# Altium project f407zgt6.PrjPcb
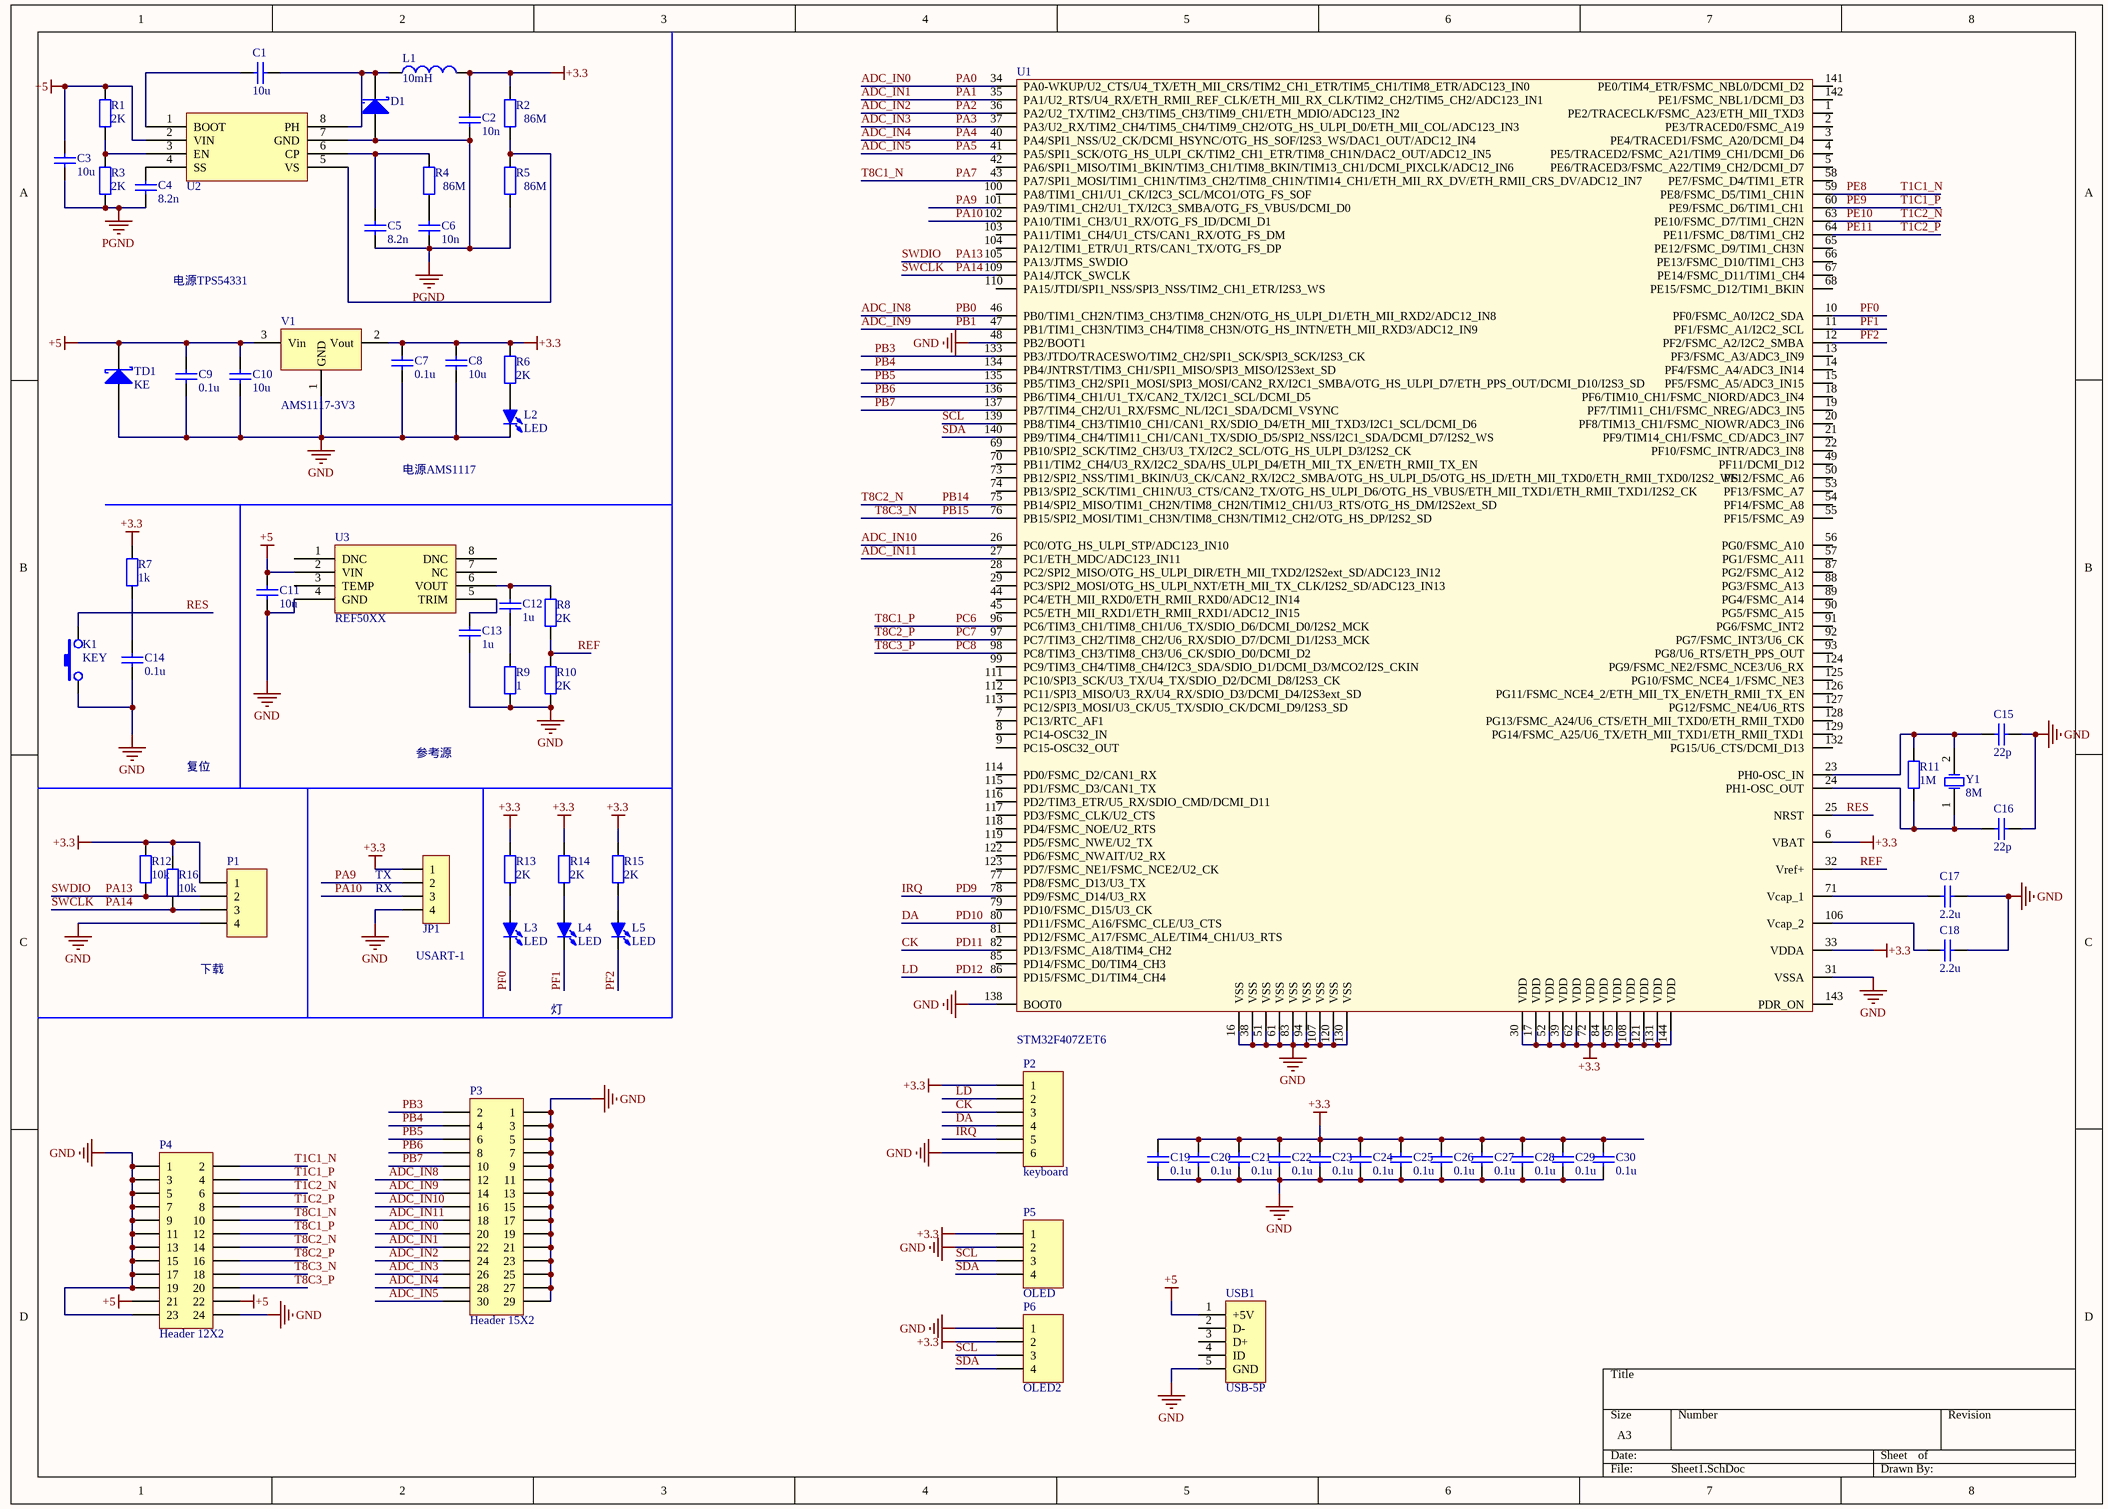
[diagram p0: Sheet1.SchDoc]
1 sheet, 67 parts. Net scope: global (net labels, ports and power ports of the same name join across sheets).
Board file: PCB1.PcbDoc

## Sheet Sheet1.SchDoc
size A3; SheetNumber: 1; SheetTotal: 1

### Parts
C1  10u  [6-0805_N]
C2  10n  [6-0805_N]
C3  10u  [6-0805_N]
C4  8.2n  [6-0805_N]
C5  8.2n  [6-0805_N]
C6  10n  [6-0805_N]
C7  0.1u  [C 0603_L]
C8  10u  [C 0805_L]
C9  0.1u  [C 0805_L]
C10  10u  [C 0603_L]
C11  10u  [C 0603_L]
C12  1u  [C 0603_L]
C13  1u  [C 0603_L]
C14  0.1u  [C 0603_L]
C15  22p  [C 0603_L]
C16  22p  [C 0603_L]
C17  2.2u  [C 0805_M]
C18  2.2u  [C 0805_M]
C19  0.1u  [C 0603_L]
C20  0.1u  [C 0603_L]
C21  0.1u  [C 0603_L]
C22  0.1u  [C 0603_L]
C23  0.1u  [C 0603_L]
C24  0.1u  [C 0603_L]
C25  0.1u  [C 0603_L]
C26  0.1u  [C 0603_L]
C27  0.1u  [C 0603_L]
C28  0.1u  [C 0603_L]
C29  0.1u  [C 0603_L]
C30  0.1u  [C 0603_L]
D1  D Schottky  [SMA]  (value not drawn)
JP1  HDR-1X4  [XH2.54-WI-4P]  (value not drawn)
K1  KEY  [KEY-6*6*6]
L1  value 10mH  [SWPA4030S]  (hidden comment: Inductor)
L2  LED  [LED 0805G]
L3  LED  [LED 0805G]
L4  LED  [LED 0805G]
L5  LED  [LED 0805G]
P1  下载  [XH2.54-WI-4P]
P2  keyboard  [XH2.54-WI-6P]
P3  Header 15X2  [HDR2.54-WI-2x15P]
P4  Header 12X2  [HDR2.54-WI-2x12P]
P5  OLED  [HDR2.54-M-LI-4P]
P6  OLED2  [HDR2.54-M-LI-4P]
R1  2K  [R 0603_L]
R2  86M  [R 0603_L]
R3  2K  [R 0603_L]
R4  86M  [R 0603_L]
R5  86M  [R 0603_L]
R6  2K  [R 0603_L]
R7  1k  [R 0603_L]
R8  2K  [R 0603_L]
R9  1  [R 0603_L]
R10  2K  [R 0603_L]
R11  1M  [R 0603_L]
R12  10k  [R 0603_L]
R13  2K  [R 0603_L]
R14  2K  [R 0603_L]
R15  2K  [R 0603_L]
R16  10k  [R 0603_L]
TD1  KE  [SMB]
U1  STM32F407ZET6  [LQFP144]
U2  TPS54331  [tps5450]  (value not drawn)
U3  REF50XX  [SO-8]
USB1  USB-5P  [USB-micro_A]
V1  AMS1117-3V3  [SOT223_N]
Y1  8M  [OSC HC-49SMD]

### Nets
+3.3: C2.1 C7.2 C8.2 C19.2 C20.2 C21.2 C22.2 C23.2 C24.2 C25.2 C26.2 C27.2 C28.2 C29.2 C30.2 JP1.1 L1.2 P1.1 P2.1 P5.1 P6.2 R2.2 R6.2 R7.2 R12.2 R13.2 R14.2 R15.2 R16.2 U1.6(VBAT) U1.17(VDD) U1.30(VDD) U1.33(VDDA) U1.39(VDD) U1.52(VDD) U1.62(VDD) U1.72(VDD) U1.84(VDD) U1.95(VDD) U1.108(VDD) U1.121(VDD) U1.131(VDD) U1.144(VDD) V1.2(Vout)
+5: C3.1 C9.2 C10.2 C11.2 P4.21 P4.22 R1.2 TD1.2(K) U2.2(VIN) U3.2(VIN) USB1.1(+5V) V1.3(Vin)
GND: C7.1 C8.1 C9.1 C10.1 C11.1 C13.1 C14.1 C15.2 C16.2 C17.2 C18.2 C19.1 C20.1 C21.1 C22.1 C23.1 C24.1 C25.1 C26.1 C27.1 C28.1 C29.1 C30.1 JP1.4 K1.1 L2.2(K) P1.4 P2.6 P3.1 P3.3 P3.5 P3.7 P3.9 P3.11 P3.13 P3.15 P3.17 P3.19 P3.21 P3.23 P3.25 P3.27 P3.29 P4.1 P4.3 P4.5 P4.7 P4.9 P4.11 P4.13 P4.15 P4.17 P4.19 P4.23 P4.24 P5.2 P6.1 R9.1 R10.1 TD1.1(A) U1.16(VSS) U1.31(VSSA) U1.38(VSS) U1.48(PB2/BOOT1) U1.51(VSS) U1.61(VSS) U1.83(VSS) U1.94(VSS) U1.107(VSS) U1.120(VSS) U1.130(VSS) U1.138(BOOT0) U3.4(GND) USB1.5(GND) V1.1(GND)
PGND: C2.2 C3.2 C4.2 C5.2 C6.2 D1.1(A) R3.1 R5.1 U2.7(GND)
ADC_IN0: P3.20 U1.34(PA0-WKUP/U2_CTS/U4_TX/ETH_MII_CRS/TIM2_CH1_ETR/TIM5_CH1/TIM8_ETR/ADC123_IN0)  [also labelled PA0]
ADC_IN1: P3.22 U1.35(PA1/U2_RTS/U4_RX/ETH_RMII_REF_CLK/ETH_MII_RX_CLK/TIM2_CH2/TIM5_CH2/ADC123_IN1)  [also labelled PA1]
ADC_IN2: P3.24 U1.36(PA2/U2_TX/TIM2_CH3/TIM5_CH3/TIM9_CH1/ETH_MDIO/ADC123_IN2)  [also labelled PA2]
ADC_IN3: P3.26 U1.37(PA3/U2_RX/TIM2_CH4/TIM5_CH4/TIM9_CH2/OTG_HS_ULPI_D0/ETH_MII_COL/ADC123_IN3)  [also labelled PA3]
ADC_IN4: P3.28 U1.40(PA4/SPI1_NSS/U2_CK/DCMI_HSYNC/OTG_HS_SOF/I2S3_WS/DAC1_OUT/ADC12_IN4)  [also labelled PA4]
ADC_IN5: P3.30 U1.41(PA5/SPI1_SCK/OTG_HS_ULPI_CK/TIM2_CH1_ETR/TIM8_CH1N/DAC2_OUT/ADC12_IN5)  [also labelled PA5]
ADC_IN8: P3.12 U1.46(PB0/TIM1_CH2N/TIM3_CH3/TIM8_CH2N/OTG_HS_ULPI_D1/ETH_MII_RXD2/ADC12_IN8)  [also labelled PB0]
ADC_IN9: P3.14 U1.47(PB1/TIM1_CH3N/TIM3_CH4/TIM8_CH3N/OTG_HS_INTN/ETH_MII_RXD3/ADC12_IN9)  [also labelled PB1]
ADC_IN10: P3.16 U1.26(PC0/OTG_HS_ULPI_STP/ADC123_IN10)
ADC_IN11: P3.18 U1.27(PC1/ETH_MDC/ADC123_IN11)
CK: P2.3 U1.82(PD13/FSMC_A18/TIM4_CH2)  [also labelled PD11]
DA: P2.4 U1.80(PD11/FSMC_A16/FSMC_CLE/U3_CTS)  [also labelled PD10]
IRQ: P2.5 U1.78(PD9/FSMC_D14/U3_RX)  [also labelled PD9]
LD: P2.2 U1.86(PD15/FSMC_D1/TIM4_CH4)  [also labelled PD12]
PA7: P4.10 U1.43(PA7/SPI1_MOSI/TIM1_CH1N/TIM3_CH2/TIM8_CH1N/TIM14_CH1/ETH_MII_RX_DV/ETH_RMII_CRS_DV/ADC12_IN7)  [also labelled T8C1_N]
PA9: JP1.2 U1.101(PA9/TIM1_CH2/U1_TX/I2C3_SMBA/OTG_FS_VBUS/DCMI_D0)
PA10: JP1.3 U1.102(PA10/TIM1_CH3/U1_RX/OTG_FS_ID/DCMI_D1)
PA13: P1.2 R12.1 U1.105(PA13/JTMS_SWDIO)  [also labelled SWDIO]
PA14: P1.3 R16.1 U1.109(PA14/JTCK_SWCLK)  [also labelled SWCLK]
PB3: P3.2 U1.133(PB3/JTDO/TRACESWO/TIM2_CH2/SPI1_SCK/SPI3_SCK/I2S3_CK)
PB4: P3.4 U1.134(PB4/JNTRST/TIM3_CH1/SPI1_MISO/SPI3_MISO/I2S3ext_SD)
PB5: P3.6 U1.135(PB5/TIM3_CH2/SPI1_MOSI/SPI3_MOSI/CAN2_RX/I2C1_SMBA/OTG_HS_ULPI_D7/ETH_PPS_OUT/DCMI_D10/I2S3_SD)
PB6: P3.8 U1.136(PB6/TIM4_CH1/U1_TX/CAN2_TX/I2C1_SCL/DCMI_D5)
PB7: P3.10 U1.137(PB7/TIM4_CH2/U1_RX/FSMC_NL/I2C1_SDA/DCMI_VSYNC)
PB14: P4.14 U1.75(PB14/SPI2_MISO/TIM1_CH2N/TIM8_CH2N/TIM12_CH1/U3_RTS/OTG_HS_DM/I2S2ext_SD)  [also labelled T8C2_N]
PB15: P4.18 U1.76(PB15/SPI2_MOSI/TIM1_CH3N/TIM8_CH3N/TIM12_CH2/OTG_HS_DP/I2S2_SD)  [also labelled T8C3_N]
PC6: P4.12 U1.96(PC6/TIM3_CH1/TIM8_CH1/U6_TX/SDIO_D6/DCMI_D0/I2S2_MCK)  [also labelled T8C1_P]
PC7: P4.16 U1.97(PC7/TIM3_CH2/TIM8_CH2/U6_RX/SDIO_D7/DCMI_D1/I2S3_MCK)  [also labelled T8C2_P]
PC8: P4.20 U1.98(PC8/TIM3_CH3/TIM8_CH3/U6_CK/SDIO_D0/DCMI_D2)  [also labelled T8C3_P]
PE8: P4.2 U1.59(PE8/FSMC_D5/TIM1_CH1N)  [also labelled T1C1_N]
PE9: P4.4 U1.60(PE9/FSMC_D6/TIM1_CH1)  [also labelled T1C1_P]
PE10: P4.6 U1.63(PE10/FSMC_D7/TIM1_CH2N)  [also labelled T1C2_N]
PE11: P4.8 U1.64(PE11/FSMC_D8/TIM1_CH2)  [also labelled T1C2_P]
PF0: L3.2(K) U1.10(PF0/FSMC_A0/I2C2_SDA)
PF1: L4.2(K) U1.11(PF1/FSMC_A1/I2C2_SCL)
PF2: L5.2(K) U1.12(PF2/FSMC_A2/I2C2_SMBA)
REF: R8.1 R10.2 U1.32(Vref+)
RES: K1.2 U1.25(NRST)
SCL: P5.3 P6.3 U1.139(PB8/TIM4_CH3/TIM10_CH1/CAN1_RX/SDIO_D4/ETH_MII_TXD3/I2C1_SCL/DCMI_D6)
SDA: P5.4 P6.4 U1.140(PB9/TIM4_CH4/TIM11_CH1/CAN1_TX/SDIO_D5/SPI2_NSS/I2C1_SDA/DCMI_D7/I2S2_WS)
NetC1_1: C1.1 D1.2(K) L1.1 U2.8(PH)
NetC1_2: C1.2 U2.1(BOOT)
NetC4_1: C4.1 U2.4(SS)
NetC5_1: C5.1 R4.2 U2.6(CP)
NetC6_1: C6.1 R4.1
NetC12_1: C12.1 R9.2
NetC12_2: C12.2 R8.2 U3.6(VOUT)
NetC13_2: C13.2 U3.5(TRIM)
NetC14_2: C14.2 R7.1
NetC15_1: C15.1 R11.2 U1.23(PH0-OSC_IN) Y1.2(OSC2)
NetC16_1: C16.1 R11.1 U1.24(PH1-OSC_OUT) Y1.1(OSC1)
NetC17_1: C17.1 U1.71(Vcap_1)
NetC18_1: C18.1 U1.106(Vcap_2)
NetL2_1: L2.1(A) R6.1
NetL3_1: L3.1(A) R13.1
NetL4_1: L4.1(A) R14.1
NetL5_1: L5.1(A) R15.1
NetR1_1: R1.1 R3.2 U2.3(EN)
NetR2_1: R2.1 R5.2 U2.5(VS)

Not connected (* = marked no-connect by the designer): U1 1(PE2/TRACECLK/FSMC_A23/ETH_MII_TXD3) 2(PE3/TRACED0/FSMC_A19) 3(PE4/TRACED1/FSMC_A20/DCMI_D4) 4(PE5/TRACED2/FSMC_A21/TIM9_CH1/DCMI_D6) 5(PE6/TRACED3/FSMC_A22/TIM9_CH2/DCMI_D7) 7(PC13/RTC_AF1) 8(PC14-OSC32_IN) 9(PC15-OSC32_OUT) 13(PF3/FSMC_A3/ADC3_IN9) 14(PF4/FSMC_A4/ADC3_IN14) 15(PF5/FSMC_A5/ADC3_IN15) 18(PF6/TIM10_CH1/FSMC_NIORD/ADC3_IN4) 19(PF7/TIM11_CH1/FSMC_NREG/ADC3_IN5) 20(PF8/TIM13_CH1/FSMC_NIOWR/ADC3_IN6) 21(PF9/TIM14_CH1/FSMC_CD/ADC3_IN7) 22(PF10/FSMC_INTR/ADC3_IN8) 28(PC2/SPI2_MISO/OTG_HS_ULPI_DIR/ETH_MII_TXD2/I2S2ext_SD/ADC123_IN12) 29(PC3/SPI2_MOSI/OTG_HS_ULPI_NXT/ETH_MII_TX_CLK/I2S2_SD/ADC123_IN13) 42(PA6/SPI1_MISO/TIM1_BKIN/TIM3_CH1/TIM8_BKIN/TIM13_CH1/DCMI_PIXCLK/ADC12_IN6) 44(PC4/ETH_MII_RXD0/ETH_RMII_RXD0/ADC12_IN14) 45(PC5/ETH_MII_RXD1/ETH_RMII_RXD1/ADC12_IN15) 49(PF11/DCMI_D12) 50(PF12/FSMC_A6) 53(PF13/FSMC_A7) 54(PF14/FSMC_A8) 55(PF15/FSMC_A9) 56(PG0/FSMC_A10) 57(PG1/FSMC_A11) 58(PE7/FSMC_D4/TIM1_ETR) 65(PE12/FSMC_D9/TIM1_CH3N) 66(PE13/FSMC_D10/TIM1_CH3) 67(PE14/FSMC_D11/TIM1_CH4) 68(PE15/FSMC_D12/TIM1_BKIN) 69(PB10/SPI2_SCK/TIM2_CH3/U3_TX/I2C2_SCL/OTG_HS_ULPI_D3/I2S2_CK) 70(PB11/TIM2_CH4/U3_RX/I2C2_SDA/HS_ULPI_D4/ETH_MII_TX_EN/ETH_RMII_TX_EN) 73(PB12/SPI2_NSS/TIM1_BKIN/U3_CK/CAN2_RX/I2C2_SMBA/OTG_HS_ULPI_D5/OTG_HS_ID/ETH_MII_TXD0/ETH_RMII_TXD0/I2S2_WS) 74(PB13/SPI2_SCK/TIM1_CH1N/U3_CTS/CAN2_TX/OTG_HS_ULPI_D6/OTG_HS_VBUS/ETH_MII_TXD1/ETH_RMII_TXD1/I2S2_CK) 77(PD8/FSMC_D13/U3_TX) 79(PD10/FSMC_D15/U3_CK) 81(PD12/FSMC_A17/FSMC_ALE/TIM4_CH1/U3_RTS) 85(PD14/FSMC_D0/TIM4_CH3) 87(PG2/FSMC_A12) 88(PG3/FSMC_A13) 89(PG4/FSMC_A14) 90(PG5/FSMC_A15) 91(PG6/FSMC_INT2) 92(PG7/FSMC_INT3/U6_CK) 93(PG8/U6_RTS/ETH_PPS_OUT) 99(PC9/TIM3_CH4/TIM8_CH4/I2C3_SDA/SDIO_D1/DCMI_D3/MCO2/I2S_CKIN) 100(PA8/TIM1_CH1/U1_CK/I2C3_SCL/MCO1/OTG_FS_SOF) 103(PA11/TIM1_CH4/U1_CTS/CAN1_RX/OTG_FS_DM) 104(PA12/TIM1_ETR/U1_RTS/CAN1_TX/OTG_FS_DP) 110(PA15/JTDI/SPI1_NSS/SPI3_NSS/TIM2_CH1_ETR/I2S3_WS) 111(PC10/SPI3_SCK/U3_TX/U4_TX/SDIO_D2/DCMI_D8/I2S3_CK) 112(PC11/SPI3_MISO/U3_RX/U4_RX/SDIO_D3/DCMI_D4/I2S3ext_SD) 113(PC12/SPI3_MOSI/U3_CK/U5_TX/SDIO_CK/DCMI_D9/I2S3_SD) 114(PD0/FSMC_D2/CAN1_RX) 115(PD1/FSMC_D3/CAN1_TX) 116(PD2/TIM3_ETR/U5_RX/SDIO_CMD/DCMI_D11) 117(PD3/FSMC_CLK/U2_CTS) 118(PD4/FSMC_NOE/U2_RTS) 119(PD5/FSMC_NWE/U2_TX) 122(PD6/FSMC_NWAIT/U2_RX) 123(PD7/FSMC_NE1/FSMC_NCE2/U2_CK) 124(PG9/FSMC_NE2/FSMC_NCE3/U6_RX) 125(PG10/FSMC_NCE4_1/FSMC_NE3) 126(PG11/FSMC_NCE4_2/ETH_MII_TX_EN/ETH_RMII_TX_EN) 127(PG12/FSMC_NE4/U6_RTS) 128(PG13/FSMC_A24/U6_CTS/ETH_MII_TXD0/ETH_RMII_TXD0) 129(PG14/FSMC_A25/U6_TX/ETH_MII_TXD1/ETH_RMII_TXD1) 132(PG15/U6_CTS/DCMI_D13) 141(PE0/TIM4_ETR/FSMC_NBL0/DCMI_D2) 142(PE1/FSMC_NBL1/DCMI_D3) 143(PDR_ON); U3 1(DNC) 3(TEMP) 7(NC) 8(DNC); USB1 2(D-) 3(D+) 4(ID)

### Notes on the sheet
- 电源TPS54331
- 电源AMS1117
- 复位
- 参考源
- (near JP1) TX
- (near JP1) RX
- USART-1
- 灯

### Library data of the parts
C1-C30 = Cap: Capacitor; Published: 8-Jun-2000; LatestRevisionDate: 17-Jul-2002; LatestRevisionNote: Re-released for DXP Platform.; PackageReference: RAD-0.3; Publisher: Altium Limited; PackageDescription: Radial Cap, Thru-Hole; 2 Leads; 0.3 in Pin Spacing
  C1 C3 C8 C10 C11: Value: 10u
  C2 C6: Value: 10n
  C4 C5: Value: 8.2n
  C7 C9 C14 C19-C30: Value: 0.1u
  C12 C13: Value: 1u
  C15 C16: Value: 22p
  C17 C18: Value: 2.2u
D1 TD1 = D Schottky: Schottky Diode; Published: 8-Jun-2000; LatestRevisionDate: 17-Jul-2002; LatestRevisionNote: Re-released for DXP Platform.; PackageReference: SMB; Publisher: Altium Limited; PackageDescription: DO-214-AA/SMB; 2 C-Bend Leads; Body 5.3 x 3.6 mm, inc. leads (LxW); Code_JEDEC: DO-214-AA
JP1 = Header 4: 4P接插件; 淘宝ID: 小糖豆的小窝窝; BOM名称: 4P接插件; 下单链接: https://item.taobao.com/item.htm?ft=t&id=613637044352
K1 = KEY: 四角直插开关; BOM名称: 四角直插开关
L1 = Inductor: Code_IEC: 1005; Published: 8-Jun-2000; LatestRevisionDate: 29-May-2009; LatestRevisionNote: IPC-7351 Footprint Added.; PackageReference: 0402-A; Publisher: Altium Limited; PackageDescription: Chip Inductor; Code_JEITA: 0402
L2-L5 = LED: 发光二极管; 淘宝ID: 小糖豆的小窝窝; BOM名称: 发光二极管; 下单链接: https://item.taobao.com/item.htm?ft=t&id=613637044352
P1 P5 P6 = Header 4: Header, 4-Pin; LatestRevisionDate: 17-Jul-2002; LatestRevisionNote: Re-released for DXP Platform.; Publisher: Altium Limited
P2 = Header 6: Header, 6-Pin; LatestRevisionDate: 17-Jul-2002; LatestRevisionNote: Re-released for DXP Platform.; Publisher: Altium Limited
P3 = Header 15X2: Header, 15-Pin, Dual row; LatestRevisionDate: 17-Jul-2002; LatestRevisionNote: Re-released for DXP Platform.; Publisher: Altium Limited
P4 = Header 12X2: Header, 12-Pin, Dual row; LatestRevisionDate: 17-Jul-2002; LatestRevisionNote: Re-released for DXP Platform.; Publisher: Altium Limited
R1-R16 = Res2: Resistor; Published: 8-Jun-2000; LatestRevisionDate: 17-Jul-2002; LatestRevisionNote: Re-released for DXP Platform.; PackageReference: AXIAL-0.4; Publisher: Altium Limited; PackageDescription: Axial Device, Thru-Hole; 2 Leads; 0.4 in Pin Spacing
  R1 R3 R6 R8 R10 R13-R15: Value: 2K
  R2 R4 R5: Value: 86M
  R7: Value: 1k
  R9: Value: 1
  R11: Value: 1M
  R12 R16: Value: 10k
U2 = TPS54331: 28V输入 3A
U3 = REF50XX: 基准源
USB1 = USB-5P: 微型USB母座; 淘宝ID: 小糖豆的小窝窝; BOM名称: 微型USB母座; 下单链接: https://item.taobao.com/item.htm?ft=t&id=613637044352
V1 = AMS1117: 三端稳压芯片; 淘宝ID: 小糖豆的小窝窝; BOM名称: 三端稳压芯片; 下单链接: https://item.taobao.com/item.htm?ft=t&id=613637044352
Y1 = XTAL: Crystal Oscillator; Published: 8-Jun-2000; LatestRevisionDate: 17-Jul-2002; LatestRevisionNote: Re-released for DXP Platform.; PackageReference: R38; Publisher: Altium Limited; PackageDescription: Crystal, Thru-Hole; 2 Leads; Body 3.1 x 8.2 mm (Dia.xH)